# Altium schematic sheet GainBlock.SchDoc: Gain Block
size A4; DrawnBy: Patrik Staudenmayer; DocumentNumber: 14; SheetNumber: 14; SheetTotal: 15
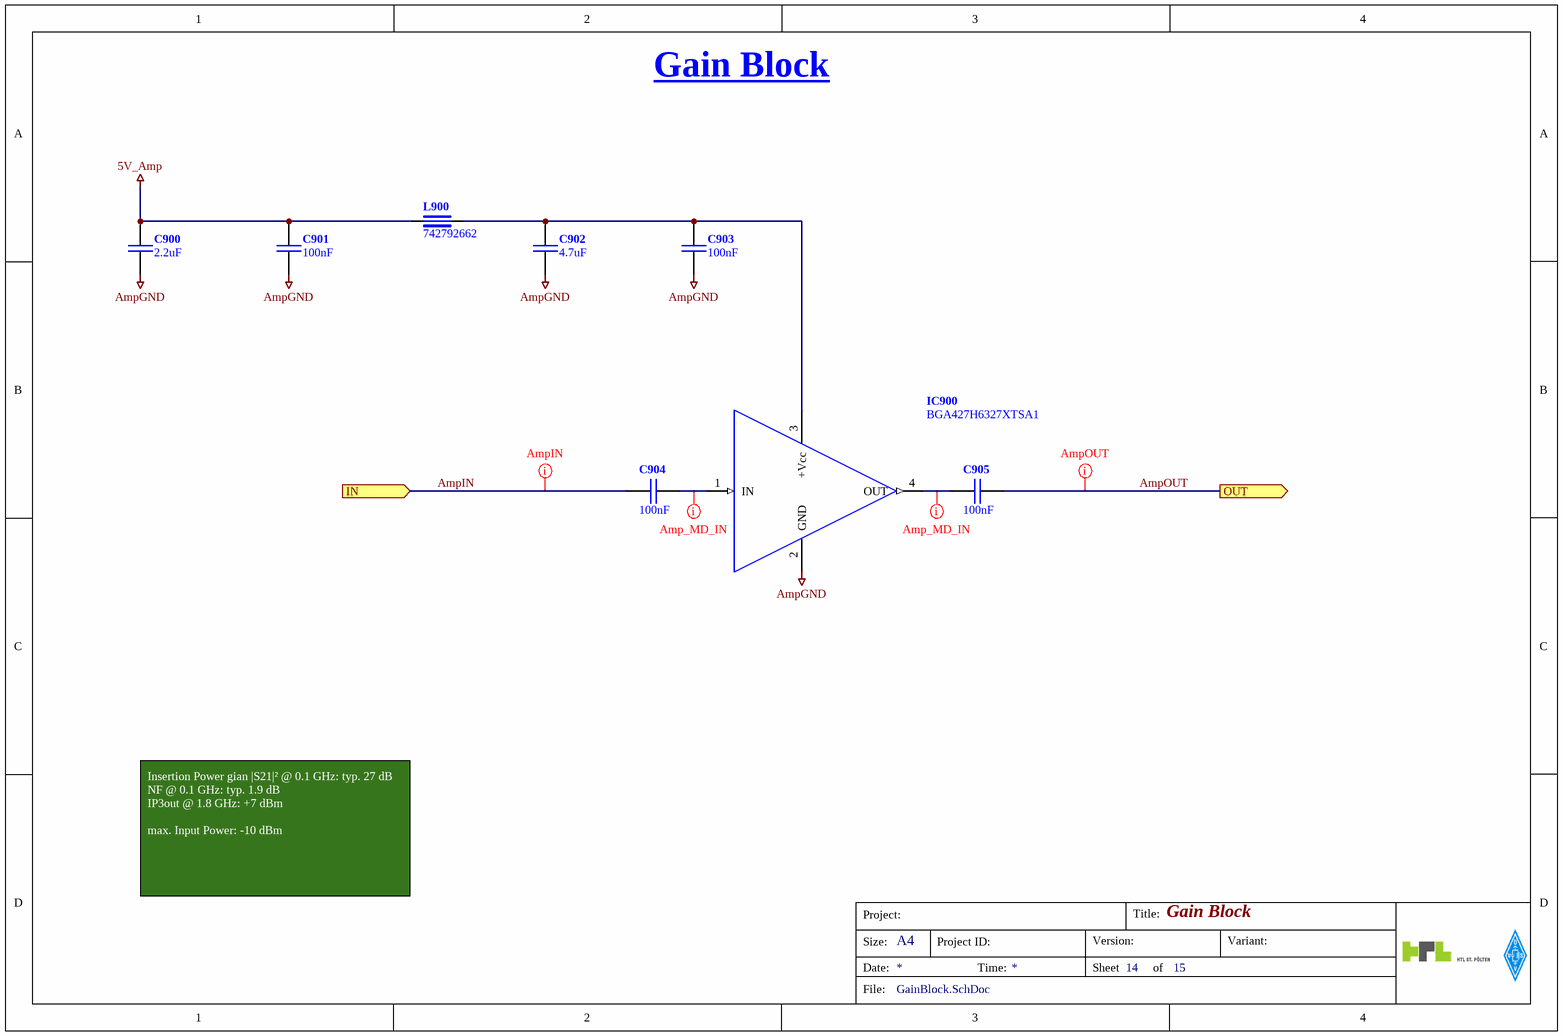
[diagram p0: GainBlock.SchDoc]

## Parts
C900  2.2uF  [C_0805_N [CAPC2013N IPC]]
C901  100nF  [C_0603_N [CAPC1608N IPC]]
C902  4.7uF  [C_0805_N [CAPC2013N IPC]]
C903  100nF  [C_0603_N [CAPC1608N IPC]]
C904  100nF  [C_0603_N [CAPC1608N IPC]]
C905  100nF  [C_0603_N [CAPC1608N IPC]]
IC900  BGA427H6327XTSA1  [SOT130P210X100-4N IPC]
L900  742792662  [L_0603_N [INDC1608N IPC]]

## Ports
IN (in), OUT (out)

## Nets
5V_Amp: C900.1 C901.1 L900.2
AmpGND: C900.2 C901.2 C902.2 C903.2 IC900.2(GND)
AmpIN: C904.2 ; port IN
AmpOUT: C905.1 ; port OUT
NetC902_1: C902.1 C903.1 IC900.3(+Vcc) L900.1
NetC904_1: C904.1 IC900.1(IN)
NetC905_2: C905.2 IC900.4(OUT)

## Layout directives
rule Width Constraint [Pref Impedance = 50.00ohms    Min Impedance = 50.00ohms    Max Impedance = 50.00ohms]: AmpIN, AmpOUT, NetC904_1, NetC905_2

## Notes on the sheet
- Gain Block
- Insertion Power gian |S21|² @ 0.1 GHz: typ. 27 dB
  NF @ 0.1 GHz: typ. 1.9 dB
  IP3out @ 1.8 GHz: +7 dBm
  max. Input Power: -10 dBm
- Project:
- Title:
- Size:
- Date:
- A4
- Project ID:
- Time:
- Sheet
- Version:
- of
- Variant:
- File:

## Library data of the parts
C900-C903 = C_GENERIC: Prometheus_ID: *; Prometheus_Manufacturer: *
  C900: Prometheus_ManPartNo: 2.2uF; Prometheus_Comment: 2.2uF; Prometheus_CurrentFootprint: C_0805_N [CAPC2013N IPC]
  C901 C903: Prometheus_ManPartNo: 100nF; Prometheus_Comment: 100nF; Prometheus_CurrentFootprint: C_0603_N [CAPC1608N IPC]
  C902: Prometheus_ManPartNo: 4.7uF; Prometheus_Comment: 4.7uF; Prometheus_CurrentFootprint: C_0805_N [CAPC2013N IPC]
C904 C905 = C_GENERIC: Prometheus_ManPartNo: 06031U101FAT2A; Prometheus_Manufacturer: AVX Corporation; Prometheus_ID: *; Prometheus_Comment: 100nF; Prometheus_CurrentFootprint: C_0603_N [CAPC1608N IPC]
IC900 = IC_BGA427: Si-MMIC-Amplifier in SIEGET® 25-Technologie / Cascadeable 50 OHM gain block / NF = 2.2 dB @ 1.8 GHz / IP3out = + 7 dBm @ 1.8 GHz (Vd = 3V, Id = 9.4 mA) / Vc = 2 V to  5V; Prometheus_Manufacturer: Infineon Technologies; Prometheus_ManPartNo: BGA427H6327XTSA1; Prometheus_Comment: BGA427H6327XTSA1; Prometheus_CurrentFootprint: SOT130P210X100-4N IPC
L900 = FB_GENERIC: Prometheus_Manufacturer: Wuerth Electronics; Prometheus_ID: *; Prometheus_ManPartNo: 742792662; Prometheus_Comment: 742792662; Prometheus_CurrentFootprint: L_0603_N [INDC1608N IPC]